# Altium schematic sheet Input.SchDoc
size A
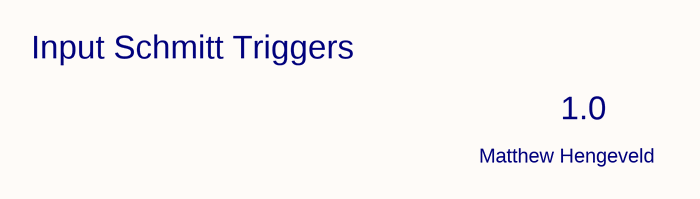
[diagram p0: Input.SchDoc]

## Notes on the sheet
- Input Schmitt Triggers
- 1.0
- Matthew Hengeveld